# Altium schematic sheet MotionSensor.SchDoc: MotionSensor
size A3; Organization: CU Boulder; DocumentNumber: 006; Revision: 1.1; SheetNumber: 6; SheetTotal: 8
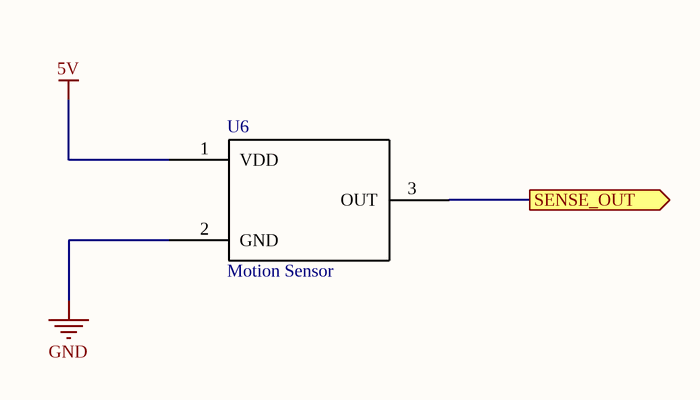
[diagram p0: MotionSensor.SchDoc]

## Parts
U6  Motion Sensor  [AMN24112]

## Ports
SENSE_OUT (out)

## Nets
5V: U6.1(VDD)
GND: U6.2(GND)
SENSE_OUT: U6.3(OUT) ; port SENSE_OUT

## Notes on the sheet
- Title
- Size:
- Date:
- A3
- Number:
- Time:
- Revision:
- Sheet
- of
- File:

## Library data of the parts
U6 = AMN24112: Supplier 1: Digi-Key; Supplier Part Number 1: 255-1818-ND